# Altium schematic sheet mcu.SchDoc
size A3
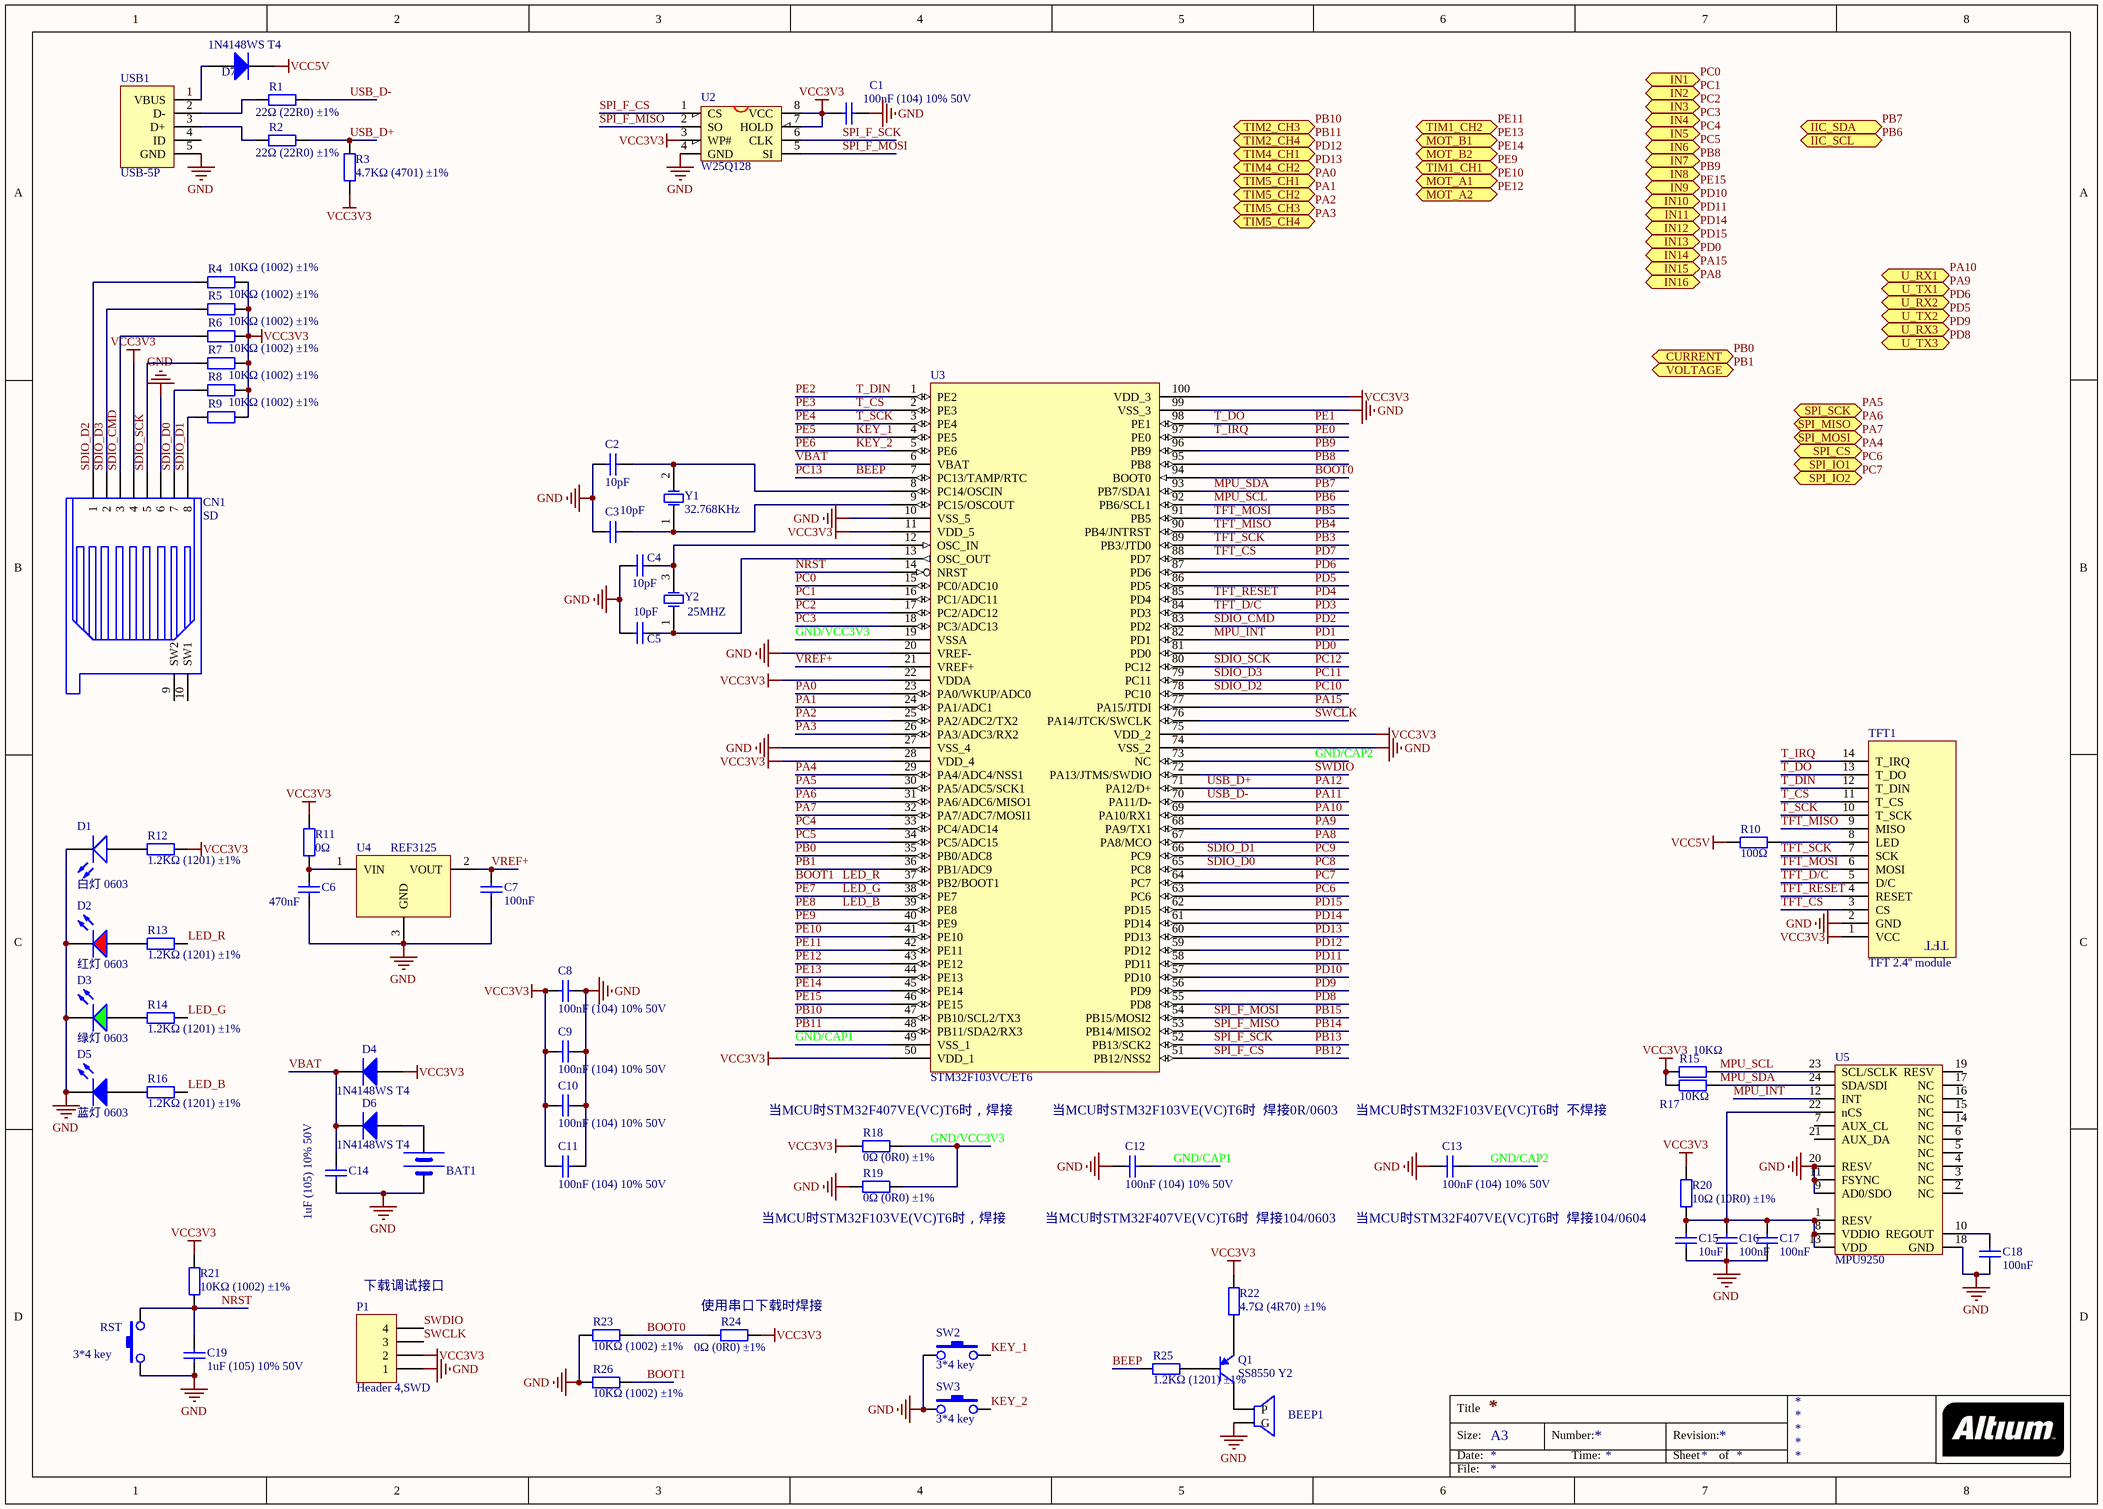
[diagram p0: mcu.SchDoc]

## Parts
BAT1  BATT  [BATM]  (value not drawn)
BEEP1  BEEP  [BELL-5]  (value not drawn)
C1  100nF (104) 10% 50V  [0603_C]
C2  10pF  [0603_C]
C3  10pF  [0603_C]
C4  10pF  [0603_C]
C5  10pF  [0603_C]
C6  470nF  [0603_C]
C7  100nF  [0603_C]
C8  100nF (104) 10% 50V  [0603_C]
C9  100nF (104) 10% 50V  [0603_C]
C10  100nF (104) 10% 50V  [0603_C]
C11  100nF (104) 10% 50V  [0603_C]
C12  100nF (104) 10% 50V  [0603_C]
C13  100nF (104) 10% 50V  [0603_C]
C14  1uF (105) 10% 50V  [0603_C]
C15  10uF  [0603_C]
C16  100nF  [0603_C]
C17  100nF  [0603_C]
C18  100nF  [0603_C]
C19  1uF (105) 10% 50V  [0603_C]
CN1  SD  [TF]
D1  白灯 0603  [0603_LED_S1]
D2  红灯 0603  [0603_LED_S1]
D3  绿灯 0603  [0603_LED_S1]
D4  1N4148WS T4  [SOD-323]
D5  蓝灯 0603  [0603_LED_S1]
D6  1N4148WS T4  [SOD-323]
D7  1N4148WS T4  [SOD-323]
P1  Header 4,SWD  [HDR1X4]
Q1  SS8550 Y2  [SOT-23(SOT-23-3)]
R1  22Ω (22R0) ±1%  [0603_R]
R2  22Ω (22R0) ±1%  [0603_R]
R3  4.7KΩ (4701) ±1%  [0603_R]
R4  10KΩ (1002) ±1%  [0603_R]
R5  10KΩ (1002) ±1%  [0603_R]
R6  10KΩ (1002) ±1%  [0603_R]
R7  10KΩ (1002) ±1%  [0603_R]
R8  10KΩ (1002) ±1%  [0603_R]
R9  10KΩ (1002) ±1%  [0603_R]
R10  100Ω  [0603_R]
R11  0Ω  [0603_R]
R12  1.2KΩ (1201) ±1%  [0603_R]
R13  1.2KΩ (1201) ±1%  [0603_R]
R14  1.2KΩ (1201) ±1%  [0603_R]
R15  10KΩ  [0603_R]
R16  1.2KΩ (1201) ±1%  [0603_R]
R17  10KΩ  [0603_R]
R18  0Ω (0R0) ±1%  [0603_R]
R19  0Ω (0R0) ±1%  [0603_R]
R20  10Ω (10R0) ±1%  [0603_R]
R21  10KΩ (1002) ±1%  [0603_R]
R22  4.7Ω (4R70) ±1%  [0603_R]
R23  10KΩ (1002) ±1%  [0603_R]
R24  0Ω (0R0) ±1%  [0603_R]
R25  1.2KΩ (1201) ±1%  [0603_R]
R26  10KΩ (1002) ±1%  [0603_R]
RST  3*4 key  [KEY-SMT]
SW2  3*4 key  [KEY-SMT]
SW3  3*4 key  [KEY-SMT]
TFT1  TFT 2.4'' module  [TFT 2.4'' module]
U2  W25Q128  [SOIC-8]
U3  STM32F103VC/ET6  [LQFP-100]
U4  REF3125  [SOT-23(SOT-23-3)]
U5  MPU9250  [QFN24-t]
USB1  USB-5P  [USB-MICRO_B]
Y1  32.768KHz  [MC-306]
Y2  25MHZ  [SMD-3225_4P]

## Ports
CURRENT (out), IIC_SCL (out), IIC_SDA (out), IN1 (out), IN2 (out), IN3 (out), IN4 (out), IN5 (out), IN6 (out), IN7 (out), IN8 (out), IN9 (out), IN10 (out), IN11 (out), IN12 (out), IN13 (out), IN14 (out), IN15 (out), IN16 (out), MOT_A1 (out), MOT_A2 (out), MOT_B1 (out), MOT_B2 (out), SPI_CS (out), SPI_IO1 (out), SPI_IO2 (out), SPI_MISO (out), SPI_MOSI (out), SPI_SCK (out), TIM1_CH1 (out), TIM1_CH2 (out), TIM2_CH3 (out), TIM2_CH4 (out), TIM4_CH1 (out), TIM4_CH2 (out), TIM5_CH1 (out), TIM5_CH2 (out), TIM5_CH3 (out), TIM5_CH4 (out), U_RX1 (out), U_RX2 (out), U_RX3 (out), U_TX1 (out), U_TX2 (out), U_TX3 (out), VOLTAGE (out)

## Nets
GND: BAT1.2(GND) BEEP1.2(G) C1.2 C2.1 C3.1 C4.1 C5.1 C6.1 C7.1 C8.2 C9.2 C10.2 C11.2 C12.1 C13.1 C14.1 C15.1 C16.1 C17.1 C18.1 C19.1 CN1.6 D1.K D2.K D3.K D5.K P1.1 R19.1 R23.2 R26.2 RST.1 SW2.1 SW3.1 TFT1.2(GND) U2.4(GND) U3.10(VSS_5) U3.20(VREF-) U3.27(VSS_4) U3.74(VSS_2) U3.99(VSS_3) U4.3(GND) U5.9(AD0/SDO) U5.11(FSYNC) U5.18(GND) U5.20(RESV) USB1.5(GND)
VCC3V3: C1.1 C8.1 C9.1 C10.1 C11.1 CN1.4 D4.1(A) P1.2 R3.1 R4.1 R5.1 R6.1 R7.1 R8.1 R9.1 R11.1 R12.2 R15.1 R17.1 R18.1 R20.2 R21.2 R22.2 R24.2 TFT1.1(VCC) U2.3(WP#) U2.7(HOLD) U2.8(VCC) U3.11(VDD_5) U3.22(VDDA) U3.28(VDD_4) U3.50(VDD_1) U3.75(VDD_2) U3.100(VDD_3)
VCC5V: D7.2(K) R10.1
BEEP: R25.1 U3.7(PC13/TAMP/RTC)  [also labelled PC13]
BOOT0: R23.1 R24.1 U3.94(BOOT0)
BOOT1: R13.2 R26.1 U3.37(PB2/BOOT1)  [also labelled LED_R]
GND/CAP1: C12.2 U3.49(VSS_1)
GND/CAP2: C13.2 U3.73(NC)
GND/VCC3V3: R18.2 R19.2 U3.19(VSSA)
KEY_1: SW2.2 U3.4(PE5)  [also labelled PE5]
KEY_2: SW3.2 U3.5(PE6)  [also labelled PE6]
LED_B: R16.2 U3.39(PE8)  [also labelled PE8]
LED_G: R14.2 U3.38(PE7)  [also labelled PE7]
MPU_INT: U3.82(PD1) U5.12(INT)  [also labelled PD1]
MPU_SCL: R15.2 U3.92(PB6/SCL1) U5.23(SCL/SCLK) ; port IIC_SCL  [also labelled PB6]
MPU_SDA: R17.2 U3.93(PB7/SDA1) U5.24(SDA/SDI) ; port IIC_SDA  [also labelled PB7]
NRST: C19.2 R21.1 RST.2 U3.14(NRST)
PA0: U3.23(PA0/WKUP/ADC0) ; port TIM5_CH1
PA1: U3.24(PA1/ADC1) ; port TIM5_CH2
PA2: U3.25(PA2/ADC2/TX2) ; port TIM5_CH3
PA3: U3.26(PA3/ADC3/RX2) ; port TIM5_CH4
PA4: U3.29(PA4/ADC4/NSS1) ; port SPI_CS
PA5: U3.30(PA5/ADC5/SCK1) ; port SPI_SCK
PA6: U3.31(PA6/ADC6/MISO1) ; port SPI_MISO
PA7: U3.32(PA7/ADC7/MOSI1) ; port SPI_MOSI
PA8: U3.67(PA8/MCO) ; port IN16
PA9: U3.68(PA9/TX1) ; port U_TX1
PA10: U3.69(PA10/RX1) ; port U_RX1
PA11: R1.2 U3.70(PA11/D-)  [also labelled USB_D-]
PA12: R2.2 R3.2 U3.71(PA12/D+)  [also labelled USB_D+]
PA15: U3.77(PA15/JTDI) ; port IN15
PB0: U3.35(PB0/ADC8) ; port CURRENT
PB1: U3.36(PB1/ADC9) ; port VOLTAGE
PB3: TFT1.7(SCK) U3.89(PB3/JTD0)  [also labelled TFT_SCK]
PB4: TFT1.9(MISO) U3.90(PB4/JNTRST)  [also labelled TFT_MISO]
PB5: TFT1.6(MOSI) U3.91(PB5)  [also labelled TFT_MOSI]
PB8: U3.95(PB8) ; port IN7
PB9: U3.96(PB9) ; port IN8
PB10: U3.47(PB10/SCL2/TX3) ; port TIM2_CH3
PB11: U3.48(PB11/SDA2/RX3) ; port TIM2_CH4
PB12: U2.1(CS) U3.51(PB12/NSS2)  [also labelled SPI_F_CS]
PB13: U2.6(CLK) U3.52(PB13/SCK2)  [also labelled SPI_F_SCK]
PB14: U2.2(SO) U3.53(PB14/MISO2)  [also labelled SPI_F_MISO]
PB15: U2.5(SI) U3.54(PB15/MOSI2)  [also labelled SPI_F_MOSI]
PC0: U3.15(PC0/ADC10) ; port IN1
PC1: U3.16(PC1/ADC11) ; port IN2
PC2: U3.17(PC2/ADC12) ; port IN3
PC3: U3.18(PC3/ADC13) ; port IN4
PC4: U3.33(PC4/ADC14) ; port IN5
PC5: U3.34(PC5/ADC15) ; port IN6
PC6: U3.63(PC6) ; port SPI_IO1
PC7: U3.64(PC7) ; port SPI_IO2
PC8: CN1.7 R8.2 U3.65(PC8)  [also labelled SDIO_D0]
PC9: CN1.8 R9.2 U3.66(PC9)  [also labelled SDIO_D1]
PC10: CN1.1 R4.2 U3.78(PC10)  [also labelled SDIO_D2]
PC11: CN1.2 R5.2 U3.79(PC11)  [also labelled SDIO_D3]
PC12: CN1.5 R7.2 U3.80(PC12)  [also labelled SDIO_SCK]
PD0: U3.81(PD0) ; port IN14
PD2: CN1.3 R6.2 U3.83(PD2)  [also labelled SDIO_CMD]
PD3: TFT1.5(D/C) U3.84(PD3)  [also labelled TFT_D/C]
PD4: TFT1.4(RESET) U3.85(PD4)  [also labelled TFT_RESET]
PD5: U3.86(PD5) ; port U_TX2
PD6: U3.87(PD6) ; port U_RX2
PD7: TFT1.3(CS) U3.88(PD7)  [also labelled TFT_CS]
PD8: U3.55(PD8) ; port U_TX3
PD9: U3.56(PD9) ; port U_RX3
PD10: U3.57(PD10) ; port IN10
PD11: U3.58(PD11) ; port IN11
PD12: U3.59(PD12) ; port TIM4_CH1
PD13: U3.60(PD13) ; port TIM4_CH2
PD14: U3.61(PD14) ; port IN12
PD15: U3.62(PD15) ; port IN13
PE0: TFT1.14(T_IRQ) U3.97(PE0)  [also labelled T_IRQ]
PE1: TFT1.13(T_DO) U3.98(PE1)  [also labelled T_DO]
PE2: TFT1.12(T_DIN) U3.1(PE2)  [also labelled T_DIN]
PE3: TFT1.11(T_CS) U3.2(PE3)  [also labelled T_CS]
PE4: TFT1.10(T_SCK) U3.3(PE4)  [also labelled T_SCK]
PE9: U3.40(PE9) ; port TIM1_CH1
PE10: U3.41(PE10) ; port MOT_A1
PE11: U3.42(PE11) ; port TIM1_CH2
PE12: U3.43(PE12) ; port MOT_A2
PE13: U3.44(PE13) ; port MOT_B1
PE14: U3.45(PE14) ; port MOT_B2
PE15: U3.46(PE15) ; port IN9
SWCLK: P1.3 U3.76(PA14/JTCK/SWCLK)
SWDIO: P1.4 U3.72(PA13/JTMS/SWDIO)
VBAT: C14.2 D4.2(K) D6.2(K) U3.6(VBAT)
VREF+: C7.2 U3.21(VREF+) U4.2(VOUT)
NetBAT1_1: BAT1.1(VCC) D6.1(A)
NetBEEP1_1: BEEP1.1(P) Q1.3(C)
NetC2_2: C2.2 U3.8(PC14/OSCIN) Y1.2(OSC2)
NetC3_2: C3.2 U3.9(PC15/OSCOUT) Y1.1(OSC1)
NetC4_2: C4.2 U3.12(OSC_IN) Y2.3(OSC2)
NetC5_2: C5.2 U3.13(OSC_OUT) Y2.1(OSC1)
NetC6_2: C6.2 R11.2 U4.1(VIN)
NetC15_2: C15.2 C16.2 C17.2 R20.1 U5.1(RESV) U5.8(VDDIO) U5.13(VDD) U5.22(nCS)
NetC18_2: C18.2 U5.10(REGOUT)
NetD1_A: D1.A R12.1
NetD2_A: D2.A R13.1
NetD3_A: D3.A R14.1
NetD5_A: D5.A R16.1
NetD7_1: D7.1(A) USB1.1(VBUS)
NetQ1_1: Q1.1(B) R25.2
NetQ1_2: Q1.2(E) R22.1
NetR1_1: R1.1 USB1.2(D-)
NetR2_1: R2.1 USB1.3(D+)
NetR10_2: R10.2 TFT1.8(LED)

Not connected (* = marked no-connect by the designer): CN1 9(SW2) 10(SW1); U5 2(NC) 3(NC) 4(NC) 5(NC) 6(NC) 7(AUX_CL) 14(NC) 15(NC) 16(NC) 17(NC) 19(RESV) 21(AUX_DA); USB1 4(ID)

## Notes on the sheet
- (near R18) 当MCU时STM32F407VE(VC)T6时，焊接
- 当MCU时STM32F103VE(VC)T6时  焊接0R/0603
- (near C13) 当MCU时STM32F103VE(VC)T6时  不焊接
- (near R19) 当MCU时STM32F103VE(VC)T6时，焊接
- 当MCU时STM32F407VE(VC)T6时  焊接104/0603
- (near C13) 当MCU时STM32F407VE(VC)T6时  焊接104/0604
- (near P1) 下载调试接口
- (near R24) 使用串口下载时焊接
- Title
- Size:
- Date:
- A3
- Number:
- Time:
- Revision:
- Sheet
- of
- File:
- (in symbol TFT 2.4'' module) TFT

## Library data of the parts
BAT1 = BAT
C1 C7-C13 C16-C18 = 0603 100nF (104) 10% 50V: 贴片电容; ComponentLink1Description: 供应商链接; ComponentLink1URL: http://www.szlcsc.com/product/details_15331.html; Package: 0603; Supplier: LC; SuppliersPartNumber: C14663
C2-C5 = 0603 10pF (100) 5% 50V: 贴片电容; ComponentLink1Description: 供应商链接; ComponentLink1URL: http://www.szlcsc.com/product/details_1986.html; Package: 0603; Supplier: LC; SuppliersPartNumber: C1634
C6 = 0603 470nF (474) 10% 25V: 贴片电容; ComponentLink1Description: 供应商链接; ComponentLink1URL: http://www.szlcsc.com/product/details_1975.html; Package: 0603; Supplier: LC; SuppliersPartNumber: C1623
C14 C19 = 0603 1uF (105) 10% 50V: 贴片电容; ComponentLink1Description: 供应商链接; ComponentLink1URL: http://www.szlcsc.com/product/details_16531.html; Package: 0603; Supplier: LC; SuppliersPartNumber: C15849
C15 = 0603 10uF (106) 10% 10V: 贴片电容; ComponentLink1Description: 供应商链接; ComponentLink1URL: http://www.szlcsc.com/product/details_20411.html; Package: 0603; Supplier: LC; SuppliersPartNumber: C19702
CN1 = SMS016AFA5E
D1 = 0603 白灯: 发光二极管; ComponentLink1Description: 供应商链接; ComponentLink1URL: http://www.szlcsc.com/product/details_2663.html; Package: 0603; Supplier: LC; SuppliersPartNumber: C2290
D2 = 0603 红灯: 发光二极管; ComponentLink1Description: 供应商链接; ComponentLink1URL: http://www.szlcsc.com/product/details_2659.html; Package: 0603; Supplier: LC; SuppliersPartNumber: C2286
D3 = 0603 绿灯: 发光二极管; ComponentLink1Description: 供应商链接; ComponentLink1URL: http://www.szlcsc.com/product/details_73152.html; Package: 0603; Supplier: LC; SuppliersPartNumber: C72043
D4 D6 D7 = SOD-323 1N4148WS T4: 二极管; ComponentLink1Description: 供应商链接; ComponentLink1URL: http://www.szlcsc.com/product/details_2485.html; Package: SOD-323; Supplier: LC; SuppliersPartNumber: C2128
D5 = 0603 蓝灯: 发光二极管; ComponentLink1Description: 供应商链接; ComponentLink1URL: http://www.szlcsc.com/product/details_73150.html; Package: 0603; Supplier: LC; SuppliersPartNumber: C72041
P1 = Header 4: Header, 4-Pin; LatestRevisionDate: 17-Jul-2002; LatestRevisionNote: Re-released for DXP Platform.; Publisher: Altium Limited
Q1 = SOT-23 SS8550 Y2: 三极管; ComponentLink1Description: 供应商链接; ComponentLink1URL: http://www.szlcsc.com/product/details_9037.html; Package: SOT-23; Supplier: LC; SuppliersPartNumber: C8542
R1 R2 = 0603 22Ω (22R0) 1%: 贴片电阻; ComponentLink1Description: 供应商链接; ComponentLink1URL: http://www.szlcsc.com/product/details_24078.html; Package: 0603; Supplier: LC; SuppliersPartNumber: C23345
R3 = 0603 4.7KΩ (4701) 1%: 贴片电阻; ComponentLink1Description: 供应商链接; ComponentLink1URL: http://www.szlcsc.com/product/details_23889.html; Package: 0603; Supplier: LC; SuppliersPartNumber: C23162
R4-R9 R15 R17 R21 R23 R26 = 0603 10KΩ (1002) 1%: 贴片电阻; ComponentLink1Description: 供应商链接; ComponentLink1URL: http://www.szlcsc.com/product/details_26547.html; Package: 0603; Supplier: LC; SuppliersPartNumber: C25804
R10 = 0603 100Ω (1000) 1%: 贴片电阻; ComponentLink1Description: 供应商链接; ComponentLink1URL: http://www.szlcsc.com/product/details_23502.html; Package: 0603; Supplier: LC; SuppliersPartNumber: C22775
R11 R18 R19 R24 = 0603 0Ω (0R0) 1%: 贴片电阻; ComponentLink1Description: 供应商链接; ComponentLink1URL: http://www.szlcsc.com/product/details_21903.html; Package: 0603; Supplier: LC; SuppliersPartNumber: C21189
R12-R14 R16 R25 = 0603 1.2KΩ (1201) 1%: 贴片电阻; ComponentLink1Description: 供应商链接; ComponentLink1URL: http://www.szlcsc.com/product/details_23492.html; Package: 0603; Supplier: LC; SuppliersPartNumber: C22765
R20 = 0603 10Ω (10R0) 1%: 贴片电阻; ComponentLink1Description: 供应商链接; ComponentLink1URL: http://www.szlcsc.com/product/details_23586.html; Package: 0603; Supplier: LC; SuppliersPartNumber: C22859
R22 = 0603 4.7Ω (4R70) 1%: 贴片电阻; ComponentLink1Description: 供应商链接; ComponentLink1URL: http://www.szlcsc.com/product/details_23891.html; Package: 0603; Supplier: LC; SuppliersPartNumber: C23164
RST SW2 SW3 = SW-PB_V: SWITCH
U2 = W25X16: W25X16;SST25VF016;MX25L1605
U3 = STM32F103VBH6
U4 = REF3125: 电压基准芯片
U5 = MPU9250: 9轴运动处理传感器
USB1 = USB-5P: 微型USB母座; 版权归属: 源创客; BOM名称: 微型USB母座; 学习资源: www.ooocke.com
Y1 = XTAL: Crystal Oscillator; Published: 8-Jun-2000; LatestRevisionDate: 17-Jul-2002; LatestRevisionNote: Re-released for DXP Platform.; Publisher: Altium Limited
Y2 = SMD-3225_4P  25MHZ 12PF 10PPM: 贴片晶振; ComponentLink1Description: 供应商链接; ComponentLink1URL: http://www.szlcsc.com/product/details_9526.html; Package: SMD-3225_4P; Supplier: LC; SuppliersPartNumber: C9006